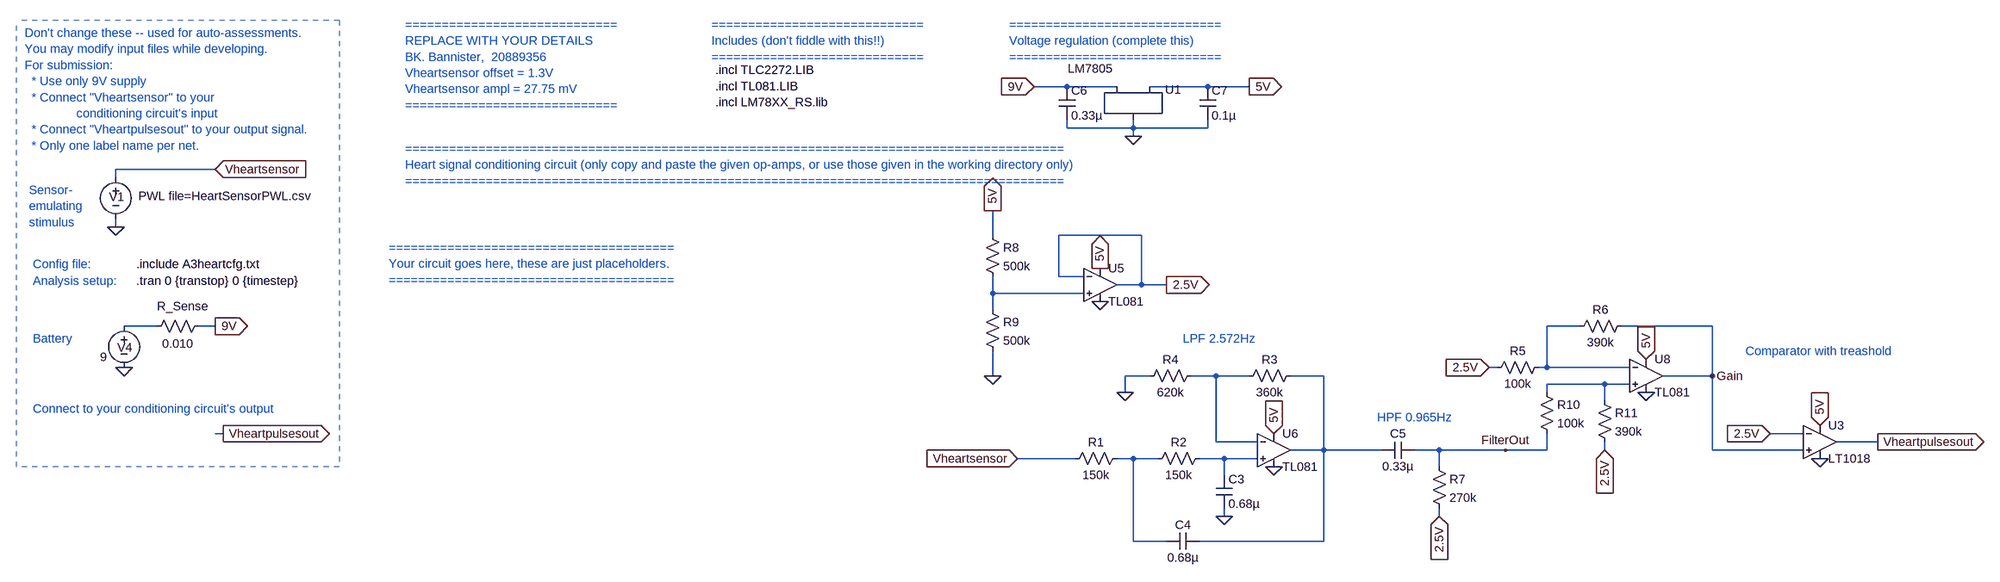
[diagram p0: schematic E344_A3_heart.asc]
E344_A3_heart.asc, the LTspice schematic file:
Version 4
SHEET 1 1824 680
WIRE -272 -1280 -336 -1280
WIRE -176 -1280 -272 -1280
WIRE 0 -1280 -112 -1280
WIRE 80 -1280 0 -1280
WIRE -272 -1200 -272 -1216
WIRE -144 -1200 -144 -1216
WIRE -144 -1200 -272 -1200
WIRE 0 -1200 0 -1216
WIRE 0 -1200 -144 -1200
WIRE -144 -1184 -144 -1200
WIRE -1920 -1120 -2112 -1120
WIRE -2112 -1104 -2112 -1120
WIRE -2112 -1008 -2112 -1024
WIRE -416 -992 -416 -1040
WIRE -128 -992 -288 -992
WIRE -288 -912 -288 -992
WIRE -240 -912 -288 -912
WIRE -128 -896 -128 -992
WIRE -128 -896 -176 -896
WIRE -80 -896 -128 -896
WIRE -416 -880 -416 -912
WIRE -240 -880 -416 -880
WIRE -416 -848 -416 -880
WIRE -2032 -816 -2096 -816
WIRE -1920 -816 -1952 -816
WIRE 720 -816 656 -816
WIRE 976 -816 800 -816
WIRE 560 -736 544 -736
WIRE 656 -736 656 -816
WIRE 656 -736 640 -736
WIRE 816 -736 656 -736
WIRE -416 -720 -416 -768
WIRE -112 -720 -160 -720
WIRE 16 -720 -32 -720
WIRE 80 -720 16 -720
WIRE 224 -720 160 -720
WIRE 976 -720 976 -816
WIRE 976 -720 880 -720
WIRE 768 -704 656 -704
WIRE 816 -704 768 -704
WIRE -160 -688 -160 -720
WIRE 656 -688 656 -704
WIRE 768 -672 768 -704
WIRE -1904 -608 -1920 -608
WIRE 1152 -608 1088 -608
WIRE 16 -592 16 -720
WIRE 96 -592 16 -592
WIRE 1296 -592 1216 -592
WIRE 224 -576 224 -720
WIRE 224 -576 160 -576
WIRE 336 -576 224 -576
WIRE 448 -576 400 -576
WIRE 576 -576 448 -576
WIRE 656 -576 656 -608
WIRE 656 -576 576 -576
WIRE 768 -576 768 -592
WIRE 976 -576 976 -720
WIRE 1152 -576 976 -576
WIRE -256 -560 -368 -560
WIRE -144 -560 -176 -560
WIRE -96 -560 -144 -560
WIRE 32 -560 -16 -560
WIRE 96 -560 32 -560
WIRE 448 -544 448 -576
WIRE 32 -528 32 -560
WIRE 32 -448 32 -464
WIRE 448 -448 448 -464
WIRE -144 -400 -144 -560
WIRE -80 -400 -144 -400
WIRE 224 -400 224 -576
WIRE 224 -400 -16 -400
FLAG -2112 -1008 0
FLAG -1920 -1120 Vheartsensor
IOPIN -1920 -1120 In
FLAG -1920 -816 9V
IOPIN -1920 -816 Out
FLAG -2096 -736 0
FLAG -336 -1280 9V
IOPIN -336 -1280 In
FLAG -144 -1184 0
FLAG 80 -1280 5V
IOPIN 80 -1280 Out
FLAG -1904 -608 Vheartpulsesout
IOPIN -1904 -608 Out
FLAG -368 -560 Vheartsensor
IOPIN -368 -560 In
FLAG 32 -448 0
FLAG 128 -544 0
FLAG -160 -688 0
FLAG 128 -608 5V
IOPIN 128 -608 In
FLAG 1184 -560 0
FLAG 1184 -624 5V
IOPIN 1184 -624 In
FLAG 576 -576 FilterOut
FLAG 848 -752 5V
IOPIN 848 -752 In
FLAG 848 -688 0
FLAG 976 -720 Gain
FLAG -416 -720 0
FLAG -416 -1040 5V
IOPIN -416 -1040 Out
FLAG -208 -928 5V
IOPIN -208 -928 Out
FLAG -208 -864 0
FLAG -80 -896 2.5V
IOPIN -80 -896 Out
FLAG 768 -576 2.5V
IOPIN 768 -576 In
FLAG 544 -736 2.5V
IOPIN 544 -736 In
FLAG 1088 -608 2.5V
IOPIN 1088 -608 In
FLAG 1296 -592 Vheartpulsesout
IOPIN 1296 -592 Out
FLAG 448 -448 2.5V
IOPIN 448 -448 In
SYMBOL voltage -2112 -1120 R0
WINDOW 123 0 0 Left 0
WINDOW 39 0 0 Left 0
WINDOW 3 44 52 Left 2
WINDOW 0 -13 54 Left 2
SYMATTR Value PWL file=HeartSensorPWL.csv
SYMATTR InstName V1
SYMBOL voltage -2096 -832 R0
WINDOW 123 24 44 Left 2
WINDOW 39 0 0 Left 0
WINDOW 3 -46 76 Left 2
WINDOW 0 -13 57 Left 2
SYMATTR Value 9
SYMATTR InstName V4
SYMBOL res -1936 -832 R90
WINDOW 0 -7 47 VBottom 2
WINDOW 3 34 56 VTop 2
SYMATTR InstName R_Sense
SYMATTR Value 0.010
SYMBOL LM7805 -144 -1264 R0
WINDOW 3 -83 -66 Top 2
SYMATTR InstName U1
SYMBOL res -160 -576 R90
WINDOW 0 0 56 VBottom 2
WINDOW 3 32 56 VTop 2
SYMATTR InstName R1
SYMATTR Value 150k
SYMBOL res 0 -576 R90
WINDOW 0 0 56 VBottom 2
WINDOW 3 32 56 VTop 2
SYMATTR InstName R2
SYMATTR Value 150k
SYMBOL res 176 -736 R90
WINDOW 0 0 56 VBottom 2
WINDOW 3 32 56 VTop 2
SYMATTR InstName R3
SYMATTR Value 360k
SYMBOL res -16 -736 R90
WINDOW 0 0 56 VBottom 2
WINDOW 3 32 56 VTop 2
SYMATTR InstName R4
SYMATTR Value 620k
SYMBOL cap 16 -528 R0
SYMATTR InstName C3
SYMATTR Value 0.68µ
SYMBOL cap -16 -416 R90
WINDOW 0 0 32 VBottom 2
WINDOW 3 32 32 VTop 2
SYMATTR InstName C4
SYMATTR Value 0.68µ
SYMBOL res 656 -752 R90
WINDOW 0 0 56 VBottom 2
WINDOW 3 32 56 VTop 2
SYMATTR InstName R5
SYMATTR Value 100k
SYMBOL res 816 -832 R90
WINDOW 0 0 56 VBottom 2
WINDOW 3 32 56 VTop 2
SYMATTR InstName R6
SYMATTR Value 390k
SYMBOL res -432 -1008 R0
SYMATTR InstName R8
SYMATTR Value 500k
SYMBOL res -432 -864 R0
SYMATTR InstName R9
SYMATTR Value 500k
SYMBOL res 640 -704 R0
SYMATTR InstName R10
SYMATTR Value 100k
SYMBOL res 752 -688 R0
SYMATTR InstName R11
SYMATTR Value 390k
SYMBOL cap -288 -1280 R0
SYMATTR InstName C6
SYMATTR Value 0.33µ
SYMBOL cap -16 -1280 R0
SYMATTR InstName C7
SYMATTR Value 0.1µ
SYMBOL opamp2 -208 -960 R0
SYMATTR InstName U5
SYMATTR Value TL081
SYMATTR SpiceModel TL081
SYMBOL opamp2 128 -640 R0
SYMATTR InstName U6
SYMATTR Value TL081
SYMATTR SpiceModel TL081
SYMBOL opamp2 848 -784 R0
SYMATTR InstName U8
SYMATTR Value TL081
SYMATTR SpiceModel TL081
SYMBOL LT1018 1184 -592 R0
SYMATTR InstName U3
SYMBOL res 432 -560 R0
SYMATTR InstName R7
SYMATTR Value 270k
SYMBOL cap 400 -592 R90
WINDOW 0 0 32 VBottom 2
WINDOW 3 32 32 VTop 2
SYMATTR InstName C5
SYMATTR Value 0.33µ
TEXT -2072 -904 Left 2 !.tran 0 {transtop} 0 {timestep}
TEXT -2072 -936 Left 2 !.include A3heartcfg.txt
TEXT -2288 -1384 Left 2 ;Don't change these -- used for auto-assessments.\nYou may modify input files while developing.\nFor submission: \n  * Use only 9V supply \n  * Connect "Vheartsensor" to your \n               conditioning circuit's input\n  * Connect "Vheartpulsesout" to your output signal.\n  * Only one label name per net.
TEXT -2272 -936 Left 2 ;Config file:
TEXT -2272 -904 Left 2 ;Analysis setup:
TEXT -2272 -792 Left 2 ;Battery
TEXT -2280 -1080 Left 2 ;Sensor-\nemulating \nstimulus
TEXT -1552 -1400 Left 2 ;=============================\nREPLACE WITH YOUR DETAILS\nBK. Bannister,  20889356\nVheartsensor offset = 1.3V\nVheartsensor ampl = 27.75 mV\n=============================
TEXT -1552 -1160 Left 2 ;==========================================================================================\nHeart signal conditioning circuit (only copy and paste the given op-amps, or use those given in the working directory only)\n==========================================================================================
TEXT -384 -1400 Left 2 ;=============================\nVoltage regulation (complete this)\n=============================
TEXT -952 -1312 Left 2 !.incl TLC2272.LIB\n.incl TL081.LIB\n.incl LM78XX_RS.lib
TEXT -2272 -656 Left 2 ;Connect to your conditioning circuit's output
TEXT -960 -1400 Left 2 ;=============================\nIncludes (don't fiddle with this!!)\n=============================
TEXT -1584 -968 Left 2 ;=======================================\nYour circuit goes here, these are just placeholders.\n=======================================
TEXT -48 -792 Left 2 ;LPF 2.572Hz
TEXT 1040 -768 Left 2 ;Comparator with treashold
TEXT 328 -640 Left 2 ;HPF 0.965Hz
LINE Normal -2304 -544 -2304 -1408 1
LINE Normal -1680 -1408 -1680 -544 1
LINE Normal -1680 -544 -2304 -544 1
LINE Normal -1680 -1408 -2304 -1408 1

The netlist it stands for:
* E344_A3_heart.asc
V1 Vheartsensor 0 PWL file=HeartSensorPWL.csv
V4 N002 0 9
R_Sense 9V N002 0.010
XU1 9V 0 5V LM7805
R1 N007 Vheartsensor 150k
R2 N008 N007 150k
R3 N005 N004 360k
R4 N004 0 620k
C3 N008 0 0.68µ
C4 N005 N007 0.68µ
R5 N003 2.5V 100k
R6 Gain N003 390k
R8 5V N001 500k
R9 N001 0 500k
R10 N006 FilterOut 100k
R11 N006 2.5V 390k
C6 9V 0 0.33µ
C7 5V 0 0.1µ
XU5 N001 2.5V 5V 0 2.5V TL081 TL081  ; pins In+ In- V+ V- OUT
XU6 N008 N004 5V 0 N005 TL081 TL081  ; pins In+ In- V+ V- OUT
XU8 N006 N003 5V 0 Gain TL081 TL081  ; pins In+ In- V+ V- OUT
XU3 Gain 2.5V 5V 0 Vheartpulsesout LT1018  ; pins In+ In- V+ V- OUT
R7 FilterOut 2.5V 270k
C5 FilterOut N005 0.33µ
.tran 0 {transtop} 0 {timestep}
.include A3heartcfg.txt
* Don't change these -- used for auto-assessments.
* You may modify input files while developing.
* For submission:
*   * Use only 9V supply
*   * Connect "Vheartsensor" to your
*                conditioning circuit's input
*   * Connect "Vheartpulsesout" to your output signal.
*   * Only one label name per net.
* Config file:
* Analysis setup:
* Battery
* Sensor-
* emulating
* stimulus
* =============================
* REPLACE WITH YOUR DETAILS
* BK. Bannister,  20889356
* Vheartsensor offset = 1.3V
* Vheartsensor ampl = 27.75 mV
* =============================
* ==========================================================================================
* Heart signal conditioning circuit (only copy and paste the given op-amps, or use those given in the working directory only)
* ==========================================================================================
* =============================
* Voltage regulation (complete this)
* =============================
.incl TLC2272.LIB
.incl TL081.LIB
.incl LM78XX_RS.lib
* Connect to your conditioning circuit's output
* =============================
* Includes (don't fiddle with this!!)
* =============================
* =======================================
* Your circuit goes here, these are just placeholders.
* =======================================
* LPF 2.572Hz
* Comparator with treashold
* HPF 0.965Hz
.lib LTC1.lib
.backanno
.end